# Altium project LimeSDR_1v2.PrjPcb (part 2 of 3)

## Sheet 11_USB3_0_device.SchDoc: USB3.0 device
size A3; Organization: Lime Microsystems; Address1: Surrey Tech Centre; Address2: Guildford GU2 7YG; Address3: Surray; Address4: United Kingdom; Revision: v1.2; SheetNumber: 11; SheetTotal: 14
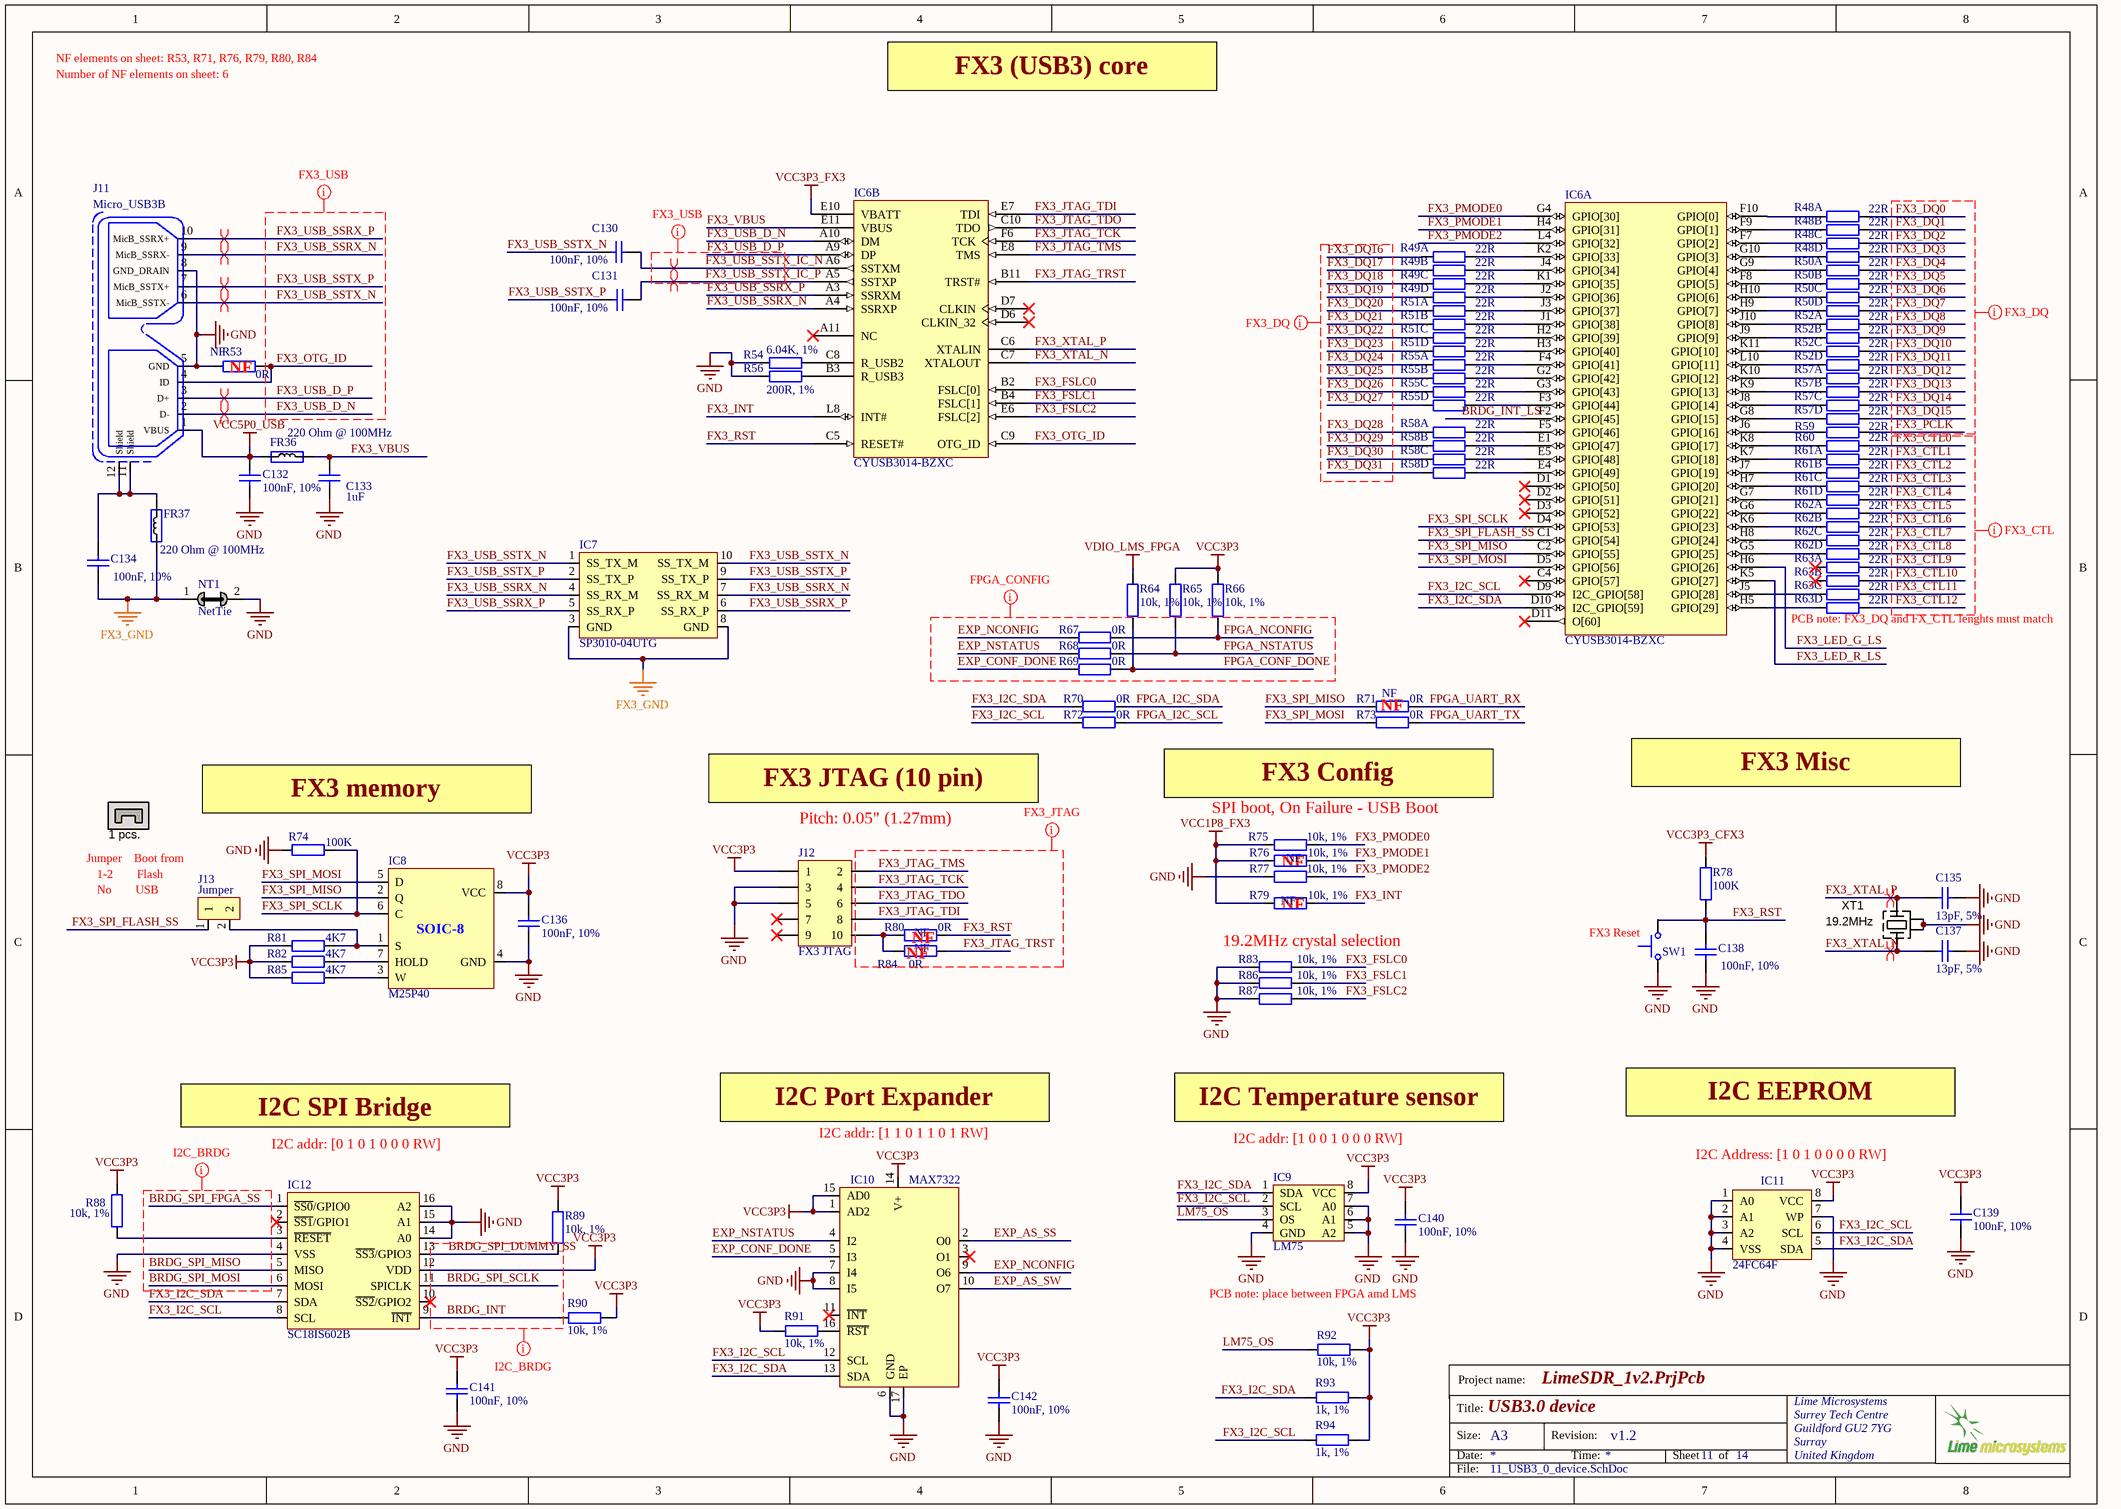
[diagram p5: 11_USB3_0_device.SchDoc]

### Parts
C130  100nF, 10%  [CAP0402]
C131  100nF, 10%  [CAP0402]
C132  100nF, 10%  [CAP0402]
C133  1uF  [CAP0603]
C134  100nF, 10%  [CAP0402]
C135  13pF, 5%  [CAP0402]
C136  100nF, 10%  [CAP0402]
C137  13pF, 5%  [CAP0402]
C138  100nF, 10%  [CAP0402]
C139  100nF, 10%  [CAP0402]
C140  100nF, 10%  [CAP0402]
C141  100nF, 10%  [CAP0402]
C142  100nF, 10%  [CAP0402]
FR36  220 Ohm @ 100MHz  [RES0402]
FR37  220 Ohm @ 100MHz  [RES0402]
IC6  CYUSB3014-BZXC  [CYP-BZX121]  (parts A,B of 3)
IC7  SP3010-04UTG  [SP3010-04UTG]
IC8  M25P40  [M25P40-VMN6TPB_SO8N]
IC9  LM75  [HWSON8_LM75]
IC10  MAX7322  [MAX7322ATE_QFN16]
IC11  24FC64F  [24FC512]
IC12  SC18IS602B  [SC18IS602B_TSSOP16]
J11  Micro_USB3B  [microUSB3B_SM_v2]
J12  FX3 JTAG  [SWD_10_pin]
J13  Jumper  [HDR_1x2_HALF_PITCH]
JMP1  1 pcs.  [MECH_JUMPER_HALF_PITCH]
NT1  NetTie  [NetTie_Wide2]  (net tie, no BOM)
R48  22R  [ChipResistorArray]  (parts A,B,C,D of 4)
R49  22R  [ChipResistorArray]  (parts A,B,C,D of 4)
R50  22R  [ChipResistorArray]  (parts A,B,C,D of 4)
R51  22R  [ChipResistorArray]  (parts A,B,C,D of 4)
R52  22R  [ChipResistorArray]  (parts A,B,C,D of 4)
R53  0R  Assembly Info: NF  [RES0402]
R54  6.04K, 1%  [RES0402]
R55  22R  [ChipResistorArray]  (parts A,B,C,D of 4)
R56  200R, 1%  [RES0402]
R57  22R  [ChipResistorArray]  (parts A,B,C,D of 4)
R58  22R  [ChipResistorArray]  (parts A,B,C,D of 4)
R59  22R  [RES0402]
R60  22R  [RES0402]
R61  22R  [ChipResistorArray]  (parts A,B,C,D of 4)
R62  22R  [ChipResistorArray]  (parts A,B,C,D of 4)
R63  22R  [ChipResistorArray]  (parts A,B,C,D of 4)
R64  10k, 1%  [RES0402]
R65  10k, 1%  [RES0402]
R66  10k, 1%  [RES0402]
R67  0R  [RES0402]
R68  0R  [RES0402]
R69  0R  [RES0402]
R70  0R  [RES0402]
R71  0R  Assembly Info: NF  [RES0402]
R72  0R  [RES0402]
R73  0R  [RES0402]
R74  100K  [RES0402]
R75  10k, 1%  [RES0402]
R76  10k, 1%  Assembly Info: NF  [RES0402]
R77  10k, 1%  [RES0402]
R78  100K  [RES0402]
R79  10k, 1%  Assembly Info: NF  [RES0402]
R80  0R  Assembly Info: NF  [RES0402]
R81  4K7  [RES0402]
R82  4K7  [RES0402]
R83  10k, 1%  [RES0402]
R84  0R  Assembly Info: NF  [RES0402]
R85  4K7  [RES0402]
R86  10k, 1%  [RES0402]
R87  10k, 1%  [RES0402]
R88  10k, 1%  [RES0402]
R89  10k, 1%  [RES0402]
R90  10k, 1%  [RES0402]
R91  10k, 1%  [RES0402]
R92  10k, 1%  [RES0402]
R93  1k, 1%  [RES0402]
R94  1k, 1%  [RES0402]
SW1  Switch, tactile  [SW_tactile]  (value not drawn)
XT1  19.2MHz  [CRYSTAL_4-LCC_v2]

### Nets
FX3_GND: C134.2 FR37.1 IC7.3(GND) IC7.8(GND) NT1.1
GND: C132.2 C133.1 C135.1 C136.2 C137.1 C138.2 C139.2 C140.2 C141.2 C142.2 IC8.4(GND) IC9.4(GND) IC9.5(A2) IC9.6(A1) IC9.7(A0) IC10.6(GND) IC10.7(I4) IC10.8(I5) IC10.17(EP) IC11.1(A0) IC11.2(A1) IC11.3(A2) IC11.4(VSS) IC11.7(WP) IC12.4(VSS) IC12.14(A0) IC12.15(A1) IC12.16(A2) J11.5(GND) J11.8(GND_DRAIN) J12.3 J12.5 NT1.2 R53.1 R54.1 R56.1 R74.1 R77.1 R83.1 R86.1 R87.1 SW1.1 XT1.2(GND) XT1.4(GND)
VCC1P8_FX3: R75.1 R76.1 R79.1
VCC3P3: C136.1 C139.1 C140.1 C141.1 C142.1 IC8.8(VCC) IC9.8(VCC) IC10.1(AD2) IC10.14(V+) IC10.15(AD0) IC11.8(VCC) IC12.12(VDD) J12.1 R65.1 R66.1 R81.1 R82.1 R85.1 R88.1 R89.2 R90.2 R91.1 R92.2 R93.1 R94.1
VCC3P3_CFX3: R78.2
VCC3P3_FX3: IC6.E10(VBATT)
VCC5P0_USB: C132.1 FR36.1 J11.1(VBUS)
VDIO_LMS_FPGA: R64.1
BRDG_INT: IC12.9(~{INT}) R90.1
BRDG_INT_LS: IC6.F2(GPIO[45])
BRDG_SPI_DUMMY_SS: IC12.13(~{SS3}/GPIO3) R89.1
BRDG_SPI_FPGA_SS: IC12.1(~{SS0}/GPIO0)
BRDG_SPI_MISO: IC12.5(MISO)
BRDG_SPI_MOSI: IC12.6(MOSI)
BRDG_SPI_SCLK: IC12.11(SPICLK)
EXP_AS_SS: IC10.2(O0)
EXP_AS_SW: IC10.10(O7)
EXP_CONF_DONE: IC10.5(I3) R69.1
EXP_NCONFIG: IC10.9(O6) R67.1
EXP_NSTATUS: IC10.4(I2) R68.1
FPGA_CONF_DONE: R64.2 R69.2
FPGA_I2C_SCL: R72.2
FPGA_I2C_SDA: R70.2
FPGA_NCONFIG: R66.2 R67.2
FPGA_NSTATUS: R65.2 R68.2
FPGA_UART_RX: R71.2
FPGA_UART_TX: R73.2
FX3_CTL0: R60.2
FX3_CTL1: R61.2
FX3_CTL2: R61.4
FX3_CTL3: R61.6
FX3_CTL4: R61.8
FX3_CTL5: R62.2
FX3_CTL6: R62.4
FX3_CTL7: R62.6
FX3_CTL8: R62.8
FX3_CTL9: R63.2
FX3_CTL10: R63.4
FX3_CTL11: R63.6
FX3_CTL12: R63.8
FX3_DQ0: R48.2
FX3_DQ1: R48.4
FX3_DQ2: R48.6
FX3_DQ3: R48.8
FX3_DQ4: R50.2
FX3_DQ5: R50.4
FX3_DQ6: R50.6
FX3_DQ7: R50.8
FX3_DQ8: R52.2
FX3_DQ9: R52.4
FX3_DQ10: R52.6
FX3_DQ11: R52.8
FX3_DQ12: R57.2
FX3_DQ13: R57.4
FX3_DQ14: R57.6
FX3_DQ15: R57.8
FX3_DQ16: R49.1
FX3_DQ17: R49.3
FX3_DQ18: R49.5
FX3_DQ19: R49.7
FX3_DQ20: R51.1
FX3_DQ21: R51.3
FX3_DQ22: R51.5
FX3_DQ23: R51.7
FX3_DQ24: R55.1
FX3_DQ25: R55.3
FX3_DQ26: R55.5
FX3_DQ27: R55.7
FX3_DQ28: R58.1
FX3_DQ29: R58.3
FX3_DQ30: R58.5
FX3_DQ31: R58.7
FX3_FSLC0: IC6.B2(FSLC[0]) R83.2
FX3_FSLC1: IC6.B4(FSLC[1]) R86.2
FX3_FSLC2: IC6.E6(FSLC[2]) R87.2
FX3_I2C_SCL: IC6.D9(I2C_GPIO[58]) IC9.2(SCL) IC10.12(SCL) IC11.6(SCL) IC12.8(SCL) R72.1 R94.2
FX3_I2C_SDA: IC6.D10(I2C_GPIO[59]) IC9.1(SDA) IC10.13(SDA) IC11.5(SDA) IC12.7(SDA) R70.1 R93.2
FX3_INT: IC6.L8(INT#) R79.2
FX3_JTAG_TCK: IC6.F6(TCK) J12.4
FX3_JTAG_TDI: IC6.E7(TDI) J12.8
FX3_JTAG_TDO: IC6.C10(TDO) J12.6
FX3_JTAG_TMS: IC6.E8(TMS) J12.2
FX3_JTAG_TRST: IC6.B11(TRST#) R84.1
FX3_LED_G_LS: IC6.H6(GPIO[26])
FX3_LED_R_LS: IC6.K5(GPIO[27])
FX3_OTG_ID: IC6.C9(OTG_ID) J11.4(ID) R53.2
FX3_PCLK: R59.1
FX3_PMODE0: IC6.G4(GPIO[30]) R75.2
FX3_PMODE1: IC6.H4(GPIO[31]) R76.2
FX3_PMODE2: IC6.L4(GPIO[32]) R77.2
FX3_RST: C138.1 IC6.C5(RESET#) R78.1 R80.2 SW1.2
FX3_SPI_FLASH_SS: IC6.C1(GPIO[54]) J13.1
FX3_SPI_MISO: IC6.C2(GPIO[55]) IC8.2(Q) R71.1
FX3_SPI_MOSI: IC6.D5(GPIO[56]) IC8.5(D) R73.1
FX3_SPI_SCLK: IC6.D4(GPIO[53]) IC8.6(C) R74.2
FX3_USB_D_N: IC6.A10(DM) J11.2(D-)
FX3_USB_D_P: IC6.A9(DP) J11.3(D+)
FX3_USB_SSRX_N: IC6.A4(SSRXP) IC7.4(SS_RX_M) IC7.7(SS_RX_M) J11.9(MicB_SSRX-)
FX3_USB_SSRX_P: IC6.A3(SSRXM) IC7.5(SS_RX_P) IC7.6(SS_RX_P) J11.10(MicB_SSRX+)
FX3_USB_SSTX_IC_N: C130.2 IC6.A6(SSTXM)
FX3_USB_SSTX_IC_P: C131.1 IC6.A5(SSTXP)
FX3_USB_SSTX_N: C130.1 IC7.1(SS_TX_M) IC7.10(SS_TX_M) J11.6(MicB_SSTX-)
FX3_USB_SSTX_P: C131.2 IC7.2(SS_TX_P) IC7.9(SS_TX_P) J11.7(MicB_SSTX+)
FX3_VBUS: C133.2 FR36.2 IC6.E11(VBUS)
FX3_XTAL_N: C137.2 IC6.C7(XTALOUT) XT1.3(X)
FX3_XTAL_P: C135.2 IC6.C6(XTALIN) XT1.1(X)
LM75_OS: IC9.3(OS) R92.1
NetC134_1: C134.1 FR37.2 J11.11(Shield) J11.12(Shield)
NetIC6_B3: IC6.B3(R_USB3) R56.2
NetIC6_C8: IC6.C8(R_USB2) R54.2
NetIC6_E1: IC6.E1(GPIO[47]) R58.4
NetIC6_E4: IC6.E4(GPIO[49]) R58.8
NetIC6_E5: IC6.E5(GPIO[48]) R58.6
NetIC6_F3: IC6.F3(GPIO[44]) R55.8
NetIC6_F4: IC6.F4(GPIO[41]) R55.2
NetIC6_F5: IC6.F5(GPIO[46]) R58.2
NetIC6_F7: IC6.F7(GPIO[2]) R48.5
NetIC6_F8: IC6.F8(GPIO[5]) R50.3
NetIC6_F9: IC6.F9(GPIO[1]) R48.3
NetIC6_F10: IC6.F10(GPIO[0]) R48.1
NetIC6_G2: IC6.G2(GPIO[42]) R55.4
NetIC6_G3: IC6.G3(GPIO[43]) R55.6
NetIC6_G5: IC6.G5(GPIO[25]) R62.7
NetIC6_G6: IC6.G6(GPIO[22]) R62.1
NetIC6_G7: IC6.G7(GPIO[21]) R61.7
NetIC6_G8: IC6.G8(GPIO[15]) R57.7
NetIC6_G9: IC6.G9(GPIO[4]) R50.1
NetIC6_G10: IC6.G10(GPIO[3]) R48.7
NetIC6_H2: IC6.H2(GPIO[39]) R51.6
NetIC6_H3: IC6.H3(GPIO[40]) R51.8
NetIC6_H5: IC6.H5(GPIO[29]) R63.7
NetIC6_H7: IC6.H7(GPIO[20]) R61.5
NetIC6_H8: IC6.H8(GPIO[24]) R62.5
NetIC6_H9: IC6.H9(GPIO[7]) R50.7
NetIC6_H10: IC6.H10(GPIO[6]) R50.5
NetIC6_J1: IC6.J1(GPIO[38]) R51.4
NetIC6_J2: IC6.J2(GPIO[36]) R49.8
NetIC6_J3: IC6.J3(GPIO[37]) R51.2
NetIC6_J4: IC6.J4(GPIO[34]) R49.4
NetIC6_J5: IC6.J5(GPIO[28]) R63.5
NetIC6_J6: IC6.J6(GPIO[16]) R59.2
NetIC6_J7: IC6.J7(GPIO[19]) R61.3
NetIC6_J8: IC6.J8(GPIO[14]) R57.5
NetIC6_J9: IC6.J9(GPIO[9]) R52.3
NetIC6_J10: IC6.J10(GPIO[8]) R52.1
NetIC6_K1: IC6.K1(GPIO[35]) R49.6
NetIC6_K2: IC6.K2(GPIO[33]) R49.2
NetIC6_K6: IC6.K6(GPIO[23]) R62.3
NetIC6_K7: IC6.K7(GPIO[18]) R61.1
NetIC6_K8: IC6.K8(GPIO[17]) R60.1
NetIC6_K9: IC6.K9(GPIO[13]) R57.3
NetIC6_K10: IC6.K10(GPIO[12]) R57.1
NetIC6_K11: IC6.K11(GPIO[10]) R52.5
NetIC6_L10: IC6.L10(GPIO[11]) R52.7
NetIC8_1: IC8.1(S) J13.2 R81.2
NetIC8_3: IC8.3(W) R85.2
NetIC8_7: IC8.7(HOLD) R82.2
NetIC10_16: IC10.16(~{RST}) R91.2
NetIC12_3: IC12.3(~{RES}~{ET}) R88.2
NetJ12_10: J12.10 R80.1 R84.2

Not connected (* = marked no-connect by the designer): IC6 A11(NC)* C4(GPIO[57])* D1(GPIO[50])* D2(GPIO[51])* D3(GPIO[52])* D6(CLKIN_32)* D7(CLKIN)* D11(O[60])*; IC10 3(O1)* 11(~{INT})*; IC12 2(~{SS1}/GPIO1)* 10(~{SS2}/GPIO2)*; J12 7* 9*; JMP1 1 2; R63 1* 3*

### Layout directives
differential pair: FX3_USB_D_N, FX3_USB_D_P, FX3_USB_SSRX_N, FX3_USB_SSRX_P, FX3_USB_SSTX_IC_N, FX3_USB_SSTX_IC_P, FX3_USB_SSTX_N, FX3_USB_SSTX_P, FX3_XTAL_N, FX3_XTAL_P
net class FX3_DATA: FX3_OTG_ID, FX3_USB_D_N, FX3_USB_D_P, FX3_USB_SSRX_N, FX3_USB_SSRX_P, FX3_USB_SSTX_IC_N, FX3_USB_SSTX_IC_P, FX3_USB_SSTX_N, FX3_USB_SSTX_P
net class FX3_CTL: FX3_CTL0, FX3_CTL1, FX3_CTL2, FX3_CTL3, FX3_CTL4, FX3_CTL5, FX3_CTL6, FX3_CTL7, FX3_CTL8, FX3_CTL9, FX3_CTL10, FX3_CTL11, FX3_CTL12
net class FX3_DQ: FX3_DQ0, FX3_DQ1, FX3_DQ2, FX3_DQ3, FX3_DQ4, FX3_DQ5, FX3_DQ6, FX3_DQ7, FX3_DQ8, FX3_DQ9, FX3_DQ10, FX3_DQ11, FX3_DQ12, FX3_DQ13, FX3_DQ14, FX3_DQ15, FX3_DQ16, FX3_DQ17, FX3_DQ18, FX3_DQ19, FX3_DQ20, FX3_DQ21, FX3_DQ22, FX3_DQ23, FX3_DQ24, FX3_DQ25, FX3_DQ26, FX3_DQ27, FX3_DQ28, FX3_DQ29, FX3_DQ30, FX3_DQ31, FX3_PCLK
net class I2C_BRDG: BRDG_INT, BRDG_SPI_DUMMY_SS, BRDG_SPI_FPGA_SS, BRDG_SPI_MISO, BRDG_SPI_MOSI, BRDG_SPI_SCLK
net class FX3_JTAG: FX3_JTAG_TCK, FX3_JTAG_TDI, FX3_JTAG_TDO, FX3_JTAG_TMS, FX3_JTAG_TRST, FX3_RST
net class FPGA_CONFIG: EXP_CONF_DONE, EXP_NCONFIG, EXP_NSTATUS, FPGA_CONF_DONE, FPGA_NCONFIG, FPGA_NSTATUS

### Notes on the sheet
- Number of NF elements on sheet: 6
- NF elements on sheet: R53, R71, R76, R79, R80, R84
- FX3 (USB3) core
- (near R53) NF
- (near R63) PCB note: FX3_DQ and FX_CTL lenghts must match
- (near R71) NF
- FX3 Misc
- FX3 memory
- FX3 JTAG (10 pin)
- (near J12) Pitch: 0.05" (1.27mm)
- FX3 Config
- SPI boot, On Failure - USB Boot
- Jumper    Boot from
- (near J13) 1-2        Flash
- (near J13) No        USB
- (near R79) NF
- (near R76) NF
- (near R84) NF
- NF
- (near R83) 19.2MHz crystal selection
- (near SW1) FX3 Reset
- I2C SPI Bridge
- I2C Port Expander
- I2C Temperature sensor
- I2C EEPROM
- (near IC12) I2C addr: [0 1 0 1 0 0 0 RW]
- (near IC10) I2C addr: [1 1 0 1 1 0 1 RW]
- I2C addr: [1 0 0 1 0 0 0 RW]
- (near IC11) I2C Address: [1 0 1 0 0 0 0 RW]
- PCB note: place between FPGA amd LMS
- Project name:
- Title:
- Size:
- Date:
- A3
- Revision:
- Time:
- Sheet
- of
- File:
- (in symbol M25P40) SOIC-8

### Library data of the parts
C130 C131 C134 C136 C138-C142 = Cap_0603: Manufacturer Part Number 1: GRM155R71C104KA88D; Part Description: 0.10µF ±10% 16V X7R Ceramic Capacitor -55°C ~ 125°C Surface Mount, MLCC 0402 (1005 Metric) 0.039" L x 0.020" W (1.00mm x 0.50mm); Brand: Murata Electronics; Type: General Purpose MLCC; Capacitance: 0.1 uF; Temperature Coefficient / Code: +/- 15 %; Voltage Rating DC: 16 V; Supplier 1: Mouser; Supplier Part Number 1: 81-GRM155R71C104KA88; Tolerance: 10 %; Case Code - in: 0402; Manufacturer: Murata Electronics; Category: Multilayer Ceramic Capacitors MLCC - SMD/SMT; Value: 100nF, 10%; Manufacturer Part Number: GRM155R71C104KA88D
C132 = Cap_0402: Manufacturer: Murata Electronics; Manufacturer Part Number: GRM155R71C104KA88D; Part Description: 0.10µF ±10% 16V X7R Ceramic Capacitor -55°C ~ 125°C Surface Mount, MLCC 0402 (1005 Metric) 0.039" L x 0.020" W (1.00mm x 0.50mm); Voltage Rating DC: 16 V; Type: General Purpose MLCC; Capacitance: 0.1 uF; Case Length: 1 mm; Dielectric: X7R; Case Height: 0.5 mm; Temperature Coefficient / Code: +/- 15 %; Value: 100nF, 10%; Supplier 1: Mouser; Supplier Part Number 1: 81-GRM155R71C104KA88; Case Code - in: 0402; RoHS: RoHS Compliant; Operating Temperature Range: - 55 C to + 125 C; Series: GRM; Termination Style: SMD/SMT; Tolerance: 10 %; Package / Case: 0402 (1005 metric); Maximum Operating Temperature: + 125 C; Case Code - mm: 1005; Minimum Operating Temperature: - 55 C; Product Category: Low & Medium Capacitance SMD Ceramic Chip Capacitors; Packaging: Reel; Product: General Type MLCCs; Category: Multilayer Ceramic Capacitors MLCC - SMD/SMT; Brand: Murata Electronics; Case Width: 0.5 mm; RoHS - Mouser: Y; Standard Pack Qty: 10000; Minimum Order Quantity: 1; Reeling: True; Manufacturer Part Number 1: GRM155R71C104KA88D
C133 = Cap_0603: Manufacturer: Yageo; Manufacturer Part Number 1: CC0603KPX7R9BB103; Part Description: 10000pF ±10% 50V X7R Ceramic Capacitor -55°C ~ 125°C Surface Mount, MLCC 0603 (1608 Metric) 0.063" L x 0.031" W (1.60mm x 0.80mm); Temperature Coefficient: X7R; Voltage - Rated: 50V; Tolerance: ±10%; Capacitance: 10000pF; Supplier 1: Digi-Key; Supplier Part Number 1: 311-1572-1-ND; Mounting Type: Surface Mount, MLCC; Size / Dimension: 0.063" L x 0.031" W (1.60mm x 0.80mm); Package / Case: 0603 (1608 Metric); Lead Style: -; Ratings: -; Applications: General Purpose; Operating Temperature: -55°C ~ 125°C; Lead Spacing: -; Thickness (Max): 0.035" (0.90mm); Features: -; Height - Seated (Max): -; Category: Capacitors; Packaging: Cut Tape (CT); RoHS: RoHS Compliant; Value: 1uF
C135 C137 = Cap_0603: Manufacturer: Murata Electronics North America; Part Description: 13pF ±5% 50V C0G, NP0 Ceramic Capacitor -55°C ~ 125°C Surface Mount, MLCC 0402 (1005 Metric) 0.039" L x 0.020" W (1.00mm x 0.50mm); Voltage - Rated: 50V; Supplier 1: Digi-Key; Supplier Part Number 1: 490-5925-2-ND; Tolerance: ±5%; Capacitance: 13pF; Category: Capacitors; Package / Case: 0402 (1005 Metric); Value: 13pF, 5%
FR36 FR37 = Ferrite: Manufacturer: TDK Corporation; Part Description: FERRITE BEAD 220 OHM 0402 1LN; Current Rating: 900mA; DC Resistance (DCR): 220 mOhm Max; Supplier 1: Digi-Key; Impedance @ Frequency: 220 Ohm @ 100MHz; Package / Case: 0402 (1005 Metric); Category: Filters; Value: 220 Ohm @ 100MHz
  FR36: Supplier Part Number 1: 445-9329-2-ND
  FR37: Supplier Part Number: 445-9329-2-ND
IC6 = CYUSB3014-BZXC: EZ-USB(R) FX3: SuperSpeed USB Controller, 512 KB, 60 I/Os, 0 to 70 degC, 121-Pin FBGA (BZX121); Manufacturer: Cypress Semiconductor Corp; CPU Core: ARM926 EJ-S; Max. Operating Voltage (V): 1.25; Memory Architecture: SRAM; Memory Size (KB): 512; Min. Operating Voltage (V): 1.15; No. of I/Os: 60; DatasheetVersion: Rev. *O; PackageVersion: Rev. *D; PackageReference: BZX121; PackageDescription: 121-Ball FBGA, Body 10 x 10 mm, Pitch 0.8 mm; Supplier 1: Digi-Key; Supplier Part Number 1: 428-3182-ND; Supplier 2: Farnell; Supplier Part Number 2: 2355789; Supplier 3: Newark; Supplier Part Number 3: 54W7901; Supplier 4: Mouser; Supplier Part Number 4: 727-CYUSB3014-BZXC; Max. Operating Temp. (degreesC): 70; Min. Operating Temp. (degreesC): 0; RoHS: Pb-Free; Mounting Technology: Surface Mount; Code_JEDEC: PUB 95; PartNumber: CYUSB3014-BZXC; ComponentLink1Description: Manufacturer URL; ComponentLink1URL: http://www.cypress.com/; ComponentLink2Description: Datasheet; ComponentLink2URL: http://www.cypress.com/?docID=49087; ComponentLink3Description: Package Specification; ComponentLink3URL: http://www.cypress.com/?docID=45795; Part Description: EZ-USB(R) FX3: SuperSpeed USB Controller, 512 KB, 60 I/Os, 0 to 70 degC, 121-Pin FBGA (BZX121)
IC7 = SP3010-04UTG: Manufacturer: Littelfuse Inc; Part Description: TVS DIODE 6VWM 12.3VC UDFN; Supplier 1: Digi-Key; Category: Circuit Protection; Supplier Device Package: 10-µDFN (2.5x1.0); Supplier Part Number 1: F3507TR-ND; Manufacturer Part Number 1: SP3010-04UTG
IC8 = M25P40: Manufacturer: Micron Technology Inc; Part Description: IC FLASH 4MBIT 75MHZ 8SO; Manufacturer Part Number 1: M25P40-VMN6TPB; Memory Size: 4M (512K x 8); Voltage - Supply: 2.3 V ~ 3.6 V; Supplier 1: Digi-Key; Supplier Device Package: 8-SO; Supplier Part Number 1: M25P40-VMN6TPBTR-ND
IC9 = LM75: Manufacturer: NXP Semiconductors; Manufacturer Part Number: LM75BTP,147; Part Description: SENSOR TEMPERATURE I2C 8HWSON; Sensing Temperature - Local: -55°C ~ 125°C; Output Type: I²C; Accuracy - Highest (Lowest): ±2°C (±3°C); Voltage - Supply: 2.8 V ~ 5.5 V; Test Condition: -25°C ~ 100°C (-55°C ~ 125°C); Sensor Type: Digital, Local; Resolution: 10 b; Supplier 1: Digi-Key; Operating Temperature: -55°C ~ 125°C; Features: Output Switch, Programmable Limit, Shutdown Mode; Supplier Device Package: 8-HWSON (2x3); Sensing Temperature - Remote: -; Category: Sensors, Transducers; Packaging: Tape & Reel (TR); RoHS: RoHS Compliant; Package / Case: 8-WFDFN Exposed Pad; Supplier Part Number 1: 568-9815-2-ND
IC10 = MAX7322ATE+: Manufacturer: Maxim Integrated; Part Description: IC I/O EXPANDER I2C 4B 16TQFN; Interface: I²C; Number of I/O: 4 (Input Only); Voltage - Supply: 1.7 V ~ 5.5 V; Interrupt Output: Yes; Current - Output Source/Sink: 20mA; Frequency - Clock: 400kHz; Supplier 1: Digi-Key; Mounting Type: Surface Mount; Category: Integrated Circuits (ICs); RoHS: RoHS Compliant; Packaging: Tube; Manufacturer Part Number: MAX7322ATE+; Supplier Device Package: 16-TQFN-EP (3x3); Package / Case: 16-WFQFN Exposed Pad; Operating Temperature: -40°C ~ 125°C; Features: POR; Output Type: -; Supplier Part Number 1: MAX7322ATE+-ND
IC11 = 24FC64F: Manufacturer Part Number 1: 24FC64F-I/ST; Manufacturer: Microchip Technology; Part Description: IC EEPROM 512KBIT 1MHZ 8TSSOP; Format - Memory: EEPROMs - Serial; Speed: 400kHz, 1MHz; Interface: I²C, 2-Wire Serial; Memory Type: EEPROM; Memory Size: 64K (8K x 8); Voltage - Supply: 1.7 V ~ 5.5 V; Supplier 1: Digi-Key; Packaging: Tube; Supplier Device Package: 8-TSSOP; Operating Temperature: -40°C ~ 85°C; RoHS: RoHS Compliant; Category: Integrated Circuits (ICs); Package / Case: 8-TSSOP (0.173", 4.40mm Width); Supplier Part Number 1: 24FC64F-I/ST-ND
IC12 = SC18IS602: Manufacturer Part Number 1: SC18IS602BIPW,112; Manufacturer: NXP Semiconductors; Part Description: IC BRIDGE SPI/I2C 16-TSSOP; Interface: SPI; Voltage - Supply: 2.4 V ~ 3.6 V; Current - Supply: 11mA; Function: Controller; Protocol: I²C; Standards: -; Operating Temperature: -40°C ~ 85°C; RoHS: RoHS Compliant; Packaging: Tube; Category: Integrated Circuits (ICs); Supplier Device Package: 16-TSSOP; Package / Case: 16-TSSOP (0.173", 4.40mm Width); Supplier 1: Digi-Key; Supplier Part Number 1: 568-4785-5-ND
J11 = Micro_USB3_B: Manufacturer: Amphenol Commercial Products; Manufacturer Part Number 1: GSB443T33HR; Part Description: USB1065-30-A  USB, 3.0 TYPE A, PLUG, SMT; Connector Type: USB - micro B; Specifications: USB 3.1, Superspeed+; Gender: Receptacle; Number of Contacts: 10; Supplier 1: Digi-Key; Supplier Part Number 1: GSB443T33HRCT-ND; Category: Connectors, Interconnects; Features: Board Guide; Ingress Protection: -; RoHS: RoHS Compliant; Packaging: Cut Tape (CT); Mounting Type: Surface Mount, Right Angle, Horizontal
J12 = Header 5X2_SWD: Header, 5-Pin, Dual row; Manufacturer Part Number 1: M50-3600542; Manufacturer: Harwin Inc; Part Description: CONN HDR 1.27MM SMD AU 10POS; Number of Positions: 10; Molding Height Above Board: 0.039" (1.00mm); Row Spacing: 0.050" (1.27mm); Number of Positions Loaded: All; Connector Type: Unshrouded; Supplier 1: Digi-Key; Contact Mating Length: 0.118" (3.00mm); Category: Connectors, Interconnects; Color: Black; RoHS: RoHS Compliant; Number of Rows: 2; Contact Finish Thickness: 3µin (0.08µm); Height Stacking (Mating): -; Contact Finish: Gold; Termination: Solder; Mounting Type: Surface Mount; Pitch: 0.050" (1.27mm); Features: -; Packaging: Bulk; Supplier Part Number 1: 952-1389-ND
J13 = Jumper: Manufacturer Part Number 1: GRPB021VWVN-RC; Manufacturer: Sullins Connector Solutions; Part Description: 2 Positions Header, Unshrouded Connector 0.050" (1.27mm) Through Hole Gold; Connector Type: Header, Unshrouded; Number of Positions: 2; Number of Positions Loaded: All; Pitch: 0.050" (1.27mm); Supplier 1: Digi-Key; Supplier Part Number 1: S9014E-02-ND; Contact Mating Length: 0.118" (3.00mm); Mounting Type: Through Hole; Termination: Solder; Fastening Type: -; Features: -; Contact Finish: Gold; Contact Finish Thickness: Flash; Color: -; Category: Connectors, Interconnects; RoHS: RoHS Compliant; Packaging: Bulk; Contact Type: Male Pin; Number of Rows: 1; Row Spacing: -
JMP1 = JUMP_2P_CONN_HEADER: Shorting Jumper, 2-position, 1.27mm pitch; Manufacturer Part Number 1: M50-2030005; Manufacturer: Harwin Inc.; Part Description: CONN SHUNT 1.27MM BLUE W/HANDLE; Gender: Female Sockets; Number of Positions or Pins (Grid): 2 (1 x 2); Pitch: 0.050" (1.27mm); Supplier 1: Digi-Key; Supplier Part Number 1: 952-1732-ND; Category: Connectors, Interconnects; RoHS: RoHS Compliant; Packaging: Bulk; Type: Closed Top, Grip; Height: 0.217" (5.50mm); Contact Finish: Gold; Contact Finish Thickness: 1µin (0.025µm); Color: Blue
R48-R52 R55 R57 R58 R61-R63 = ResArray_0802: Part Description: RES ARRAY 4 RES 22 OHM 0804; Manufacturer: Yageo; Manufacturer Part Number 1: YC124-JR-0722RL; Temperature Coefficient: ±200ppm/°C; Tolerance: ±5%; Supplier 1: Digi-Key; Supplier Part Number 1: YC124J-22TR-ND; Package / Case: 0804, Convex, Long Side Terminals; Value: 22R
R53 R67-R73 R80 = Res_0402: Manufacturer: Yageo; Part Description: RES SMD 0.0OHM JUMPER 1/16W 0402; Supplier 1: Digi-Key; Supplier Part Number 1: 311-0.0JRTR-ND; Composition: Thick Film; Package / Case: 0402 (1005 Metric); Category: Resistors; Value: 0R
R54 = Res_0402: Manufacturer: Rohm Semiconductor; Manufacturer Part Number 1: MCR01MRTF6041; Part Description: RES SMD 6.04K OHM 1% 1/16W 0402; Temperature Coefficient: ±100ppm/°C; Supplier Part Number 1: RHM6.04KCDTR-ND; Supplier 1: Digi-Key; Category: Resistors; Supplier Device Package: 0402 (1005 Metric); Composition: Thick Film; Tolerance: ±1%; Value: 6.04K, 1%
R56 = Res_0402: Manufacturer: Stackpole Electronics Inc; Part Description: RES SMD 200 OHM 1% 1/16W 0402; Power (Watts): 0.063W, 1/16W; Resistance (Ohms): 200; Temperature Coefficient: ±100ppm/°C; Supplier 1: Digi-Key; Supplier Device Package: 0402; Composition: Thick Film; Category: Resistors; Tolerance: ±1%; Supplier Part Number 1: RMCF0402FT200RDKR-ND; Value: 200R, 1%
R59 R60 = Res_0402: Part Description: RES SMD 22 OHM 1% 1/16W 0402; Tolerance: ±1%; Temperature Coefficient: ±100ppm/°C; Resistance (Ohms): 22; Supplier 1: Digi-Key; Supplier Part Number 1: 311-22.0LRTR-ND; Supplier Device Package: 0402; Composition: Thick Film; Category: Resistors; Value: 22R
R64-R66 R75-R77 R79 R83 R86-R92 = Res_0402: Manufacturer: Yageo; Manufacturer Part Number 1: RC0402FR-0710KL; Part Description: RES SMD 10K OHM 1% 1/16W 0402; Temperature Coefficient: ±100ppm/°C; Power (Watts): 0.063W, 1/16W; Value: 10k, 1%; Supplier 1: Digi-Key; Supplier Part Number 1: 311-10.0KLRTR-ND; Resistance (Ohms): 10k; Packaging: Tape & Reel (TR); RoHS: RoHS Compliant; Package / Case: 0402 (1005 Metric); Tolerance: ±1%; Operating Temperature: -55°C ~ 155°C; Size / Dimension: 0.039" L x 0.020" W (1.00mm x 0.50mm); Number of Terminations: 2; Category: Resistors; Height: 0.016" (0.40mm); Supplier Device Package: 0402; Features: Moisture Resistant; Composition: Thick Film
R74 R78 = Res_0402: Manufacturer Part Number 1: ERJ-2GEJ104X; Manufacturer: Panasonic Electronic Components; Part Description: RES SMD 100K OHM 5% 1/10W 0402; Tolerance: ±5%; Temperature Coefficient: ±200ppm/°C; Power (Watts): 0.1W, 1/10W; Value: 100K; Supplier 1: Digi-Key; Supplier Part Number 1: P100KJCT-ND; Resistance (Ohms): 100k; Composition: Thick Film; Features: Automotive AEC-Q200; Number of Terminations: 2; Height: 0.016" (0.40mm); RoHS: RoHS Compliant; Package / Case: 0402 (1005 Metric); Packaging: Cut Tape (CT); Size / Dimension: 0.039" L x 0.020" W (1.00mm x 0.50mm); Supplier Device Package: 0402; Operating Temperature: -55°C ~ 155°C; Category: Resistors
R81 R82 R85 = Res_0402: Manufacturer Part Number 1: RMCF0402JT4K70; Part Description: RES SMD 4.7K OHM 5% 1/16W 0402; Manufacturer: Stackpole Electronics Inc.; Temperature Coefficient: ±100ppm/°C; Resistance(Ohms): 4.7k; Tolerance: ±5%; Supplier 1: Digi-Key; Composition: Thick Film; Supplier Device Package: 0402; Supplier: Digi-Key; Supplier Part Number 1: RMCF0402JT4K70TR-ND; Category: Resistors; Value: 4K7
R84 = Res_0402: Manufacturer Part Number 1: RC0402JR-070RL; Manufacturer: Yageo; Part Description: RES SMD 0.0OHM JUMPER 1/16W 0402; Resistance (Ohms): 0.0; Tolerance: Jumper; Power (Watts): 0.063W, 1/16W; Value: 0R; Supplier 1: Digi-Key; Supplier Part Number 1: 311-0.0JRTR-ND; Category: Resistors; Temperature Coefficient: -; Features: Moisture Resistant; Supplier Device Package: 0402; Height: 0.016" (0.40mm); Package / Case: 0402 (1005 Metric); Operating Temperature: -55°C ~ 155°C; Size / Dimension: 0.039" L x 0.020" W (1.00mm x 0.50mm); Composition: Thick Film; Packaging: Tape & Reel (TR); Number of Terminations: 2; RoHS: RoHS Compliant
R93 R94 = Res_0402: Manufacturer: Stackpole Electronics Inc; Manufacturer Part Number 1: RMCF0402FT1K00; Part Description: RES SMD 1K OHM 1% 1/16W 0402; Temperature Coefficient: ±100ppm/°C; Power (Watts): 0.063W, 1/16W; Value: 1k, 1%; Supplier 1: Digi-Key; Supplier Part Number 1: RMCF0402FT1K00TR-ND; Package / Case: 0402 (1005 Metric); Supplier Device Package: 0402; Height: 0.016" (0.40mm); Size / Dimension: 0.039" L x 0.020" W (1.00mm x 0.50mm); Number of Terminations: 2; Packaging: Cut Tape (CT); Category: Resistors; Composition: Thick Film; Resistance (Ohms): 1k; Tolerance: ±1%; Features: Moisture Resistant; Operating Temperature: -55°C ~ 155°C; RoHS: RoHS Compliant
SW1 = Button: Part Description: SWITCH TACTILE SPST-NO 0.05A 12V; Manufacturer: Omron Electronics Inc-EMC Div; Manufacturer Part Number 1: B3U-1000P; Outline: 3.00mm x 2.50mm; Actuator Type: Standard; Mechanical Life: 200,000 Cycles; Actuator Orientation: Top Actuated; Supplier 1: Digi-Key; Supplier Part Number 1: SW1020TR-ND; Category: Switches
XT1 = CRYSTAL_19M2: Oscillator Crystal 19.2 MHz; Manufacturer Part Number 1: 405C35B19M20000; Manufacturer: CTS-Frequency Controls; Part Description: 19.2MHz ±30ppm Crystal 13pF 60 Ohm -20°C ~ 70°C Surface Mount 4-SMD, No Lead (DFN, LCC); Frequency Tolerance: ±30ppm; ESR (Equivalent Series Resistance): 60 Ohm; Load Capacitance: 13pF; Frequency Stability: ±50ppm; Operating Mode: Fundamental; Supplier 1: Digi-Key; Supplier Part Number 1: CTX648CT-ND; Height: 0.041" (1.05mm); Category: Crystals and Oscillators; Package / Case: 4-SMD, No Lead (DFN, LCC); Mounting Type: Surface Mount; Operating Temperature: -20°C ~ 70°C; Size / Dimension: 0.197" L x 0.126" W (5.00mm x 3.20mm); Frequency: 19.2MHz

## Sheet 12_USB3_0_power.SchDoc: USB3.0 power
size A4; Organization: Lime Microsystems; Address1: Surrey Tech Centre; Address2: Guildford GU2 7YG; Address3: Surray; Address4: United Kingdom; Revision: v1.2; SheetNumber: 12; SheetTotal: 14
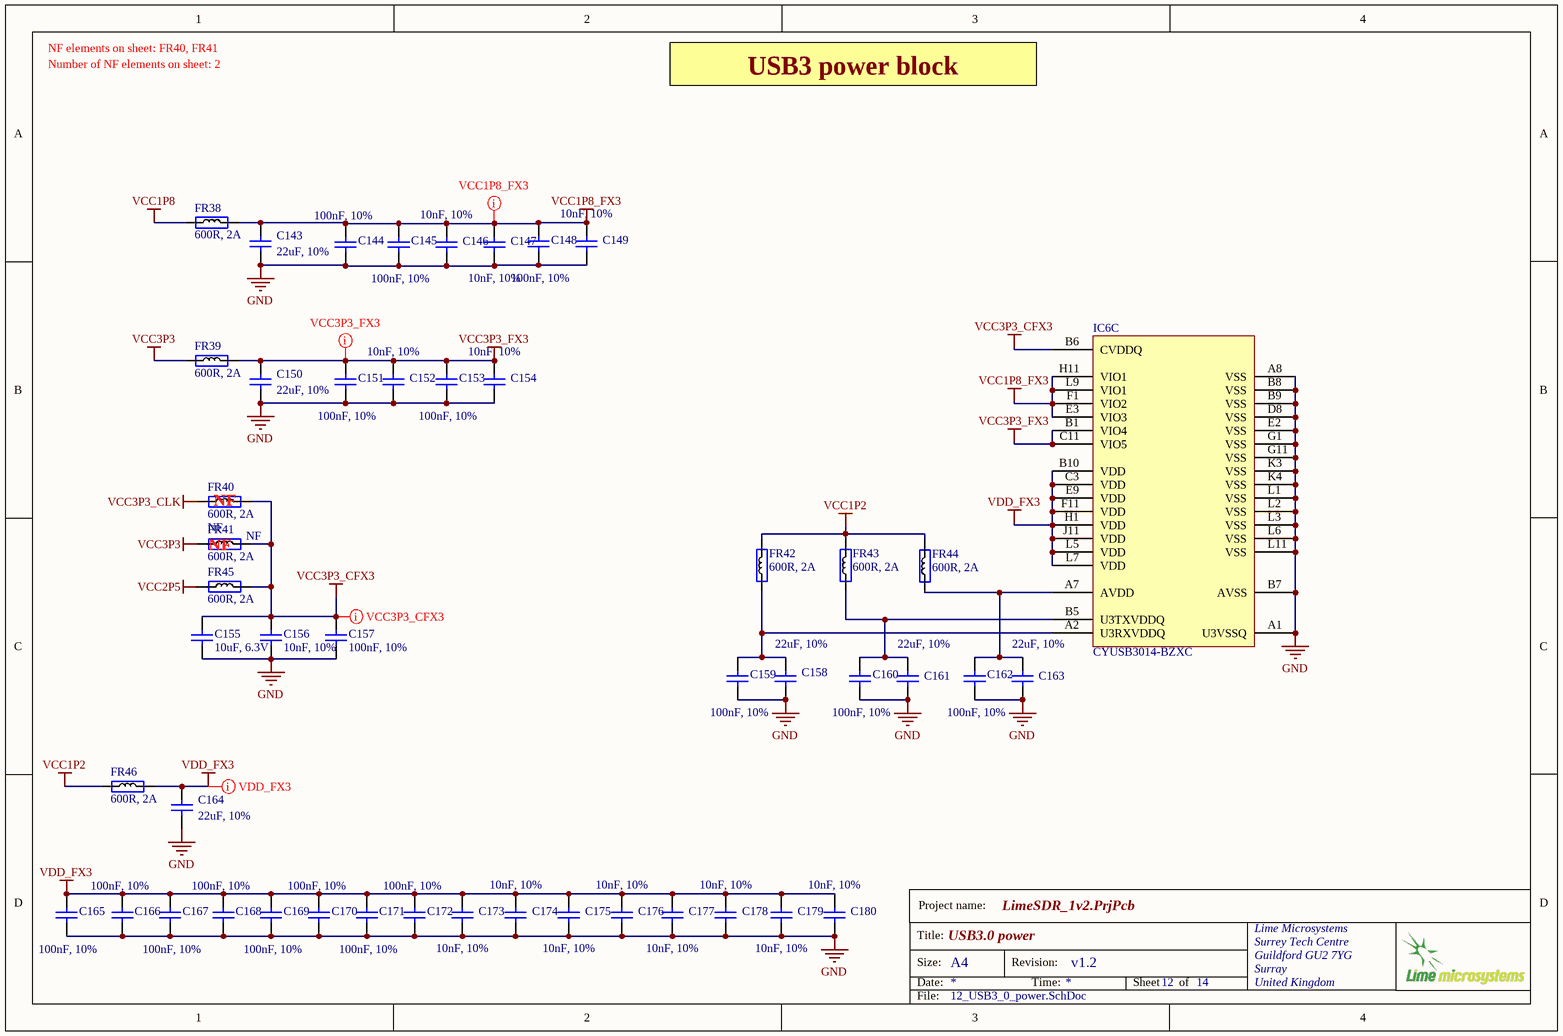
[diagram p6: 12_USB3_0_power.SchDoc]

### Parts
C143  22uF, 10%  [CAP0603]
C144  100nF, 10%  [CAP0402]
C145  100nF, 10%  [CAP0402]
C146  10nF, 10%  [CAP0402]
C147  10nF, 10%  [CAP0402]
C148  100nF, 10%  [CAP0402]
C149  10nF, 10%  [CAP0402]
C150  22uF, 10%  [CAP0603]
C151  100nF, 10%  [CAP0402]
C152  10nF, 10%  [CAP0402]
C153  100nF, 10%  [CAP0402]
C154  10nF, 10%  [CAP0402]
C155  10uF, 6.3V  [CAP0603]
C156  10nF, 10%  [CAP0402]
C157  100nF, 10%  [CAP0402]
C158  22uF, 10%  [CAP0603]
C159  100nF, 10%  [CAP0402]
C160  100nF, 10%  [CAP0402]
C161  22uF, 10%  [CAP0603]
C162  100nF, 10%  [CAP0402]
C163  22uF, 10%  [CAP0603]
C164  22uF, 10%  [CAP0603]
C165  100nF, 10%  [CAP0402]
C166  100nF, 10%  [CAP0402]
C167  100nF, 10%  [CAP0402]
C168  100nF, 10%  [CAP0402]
C169  100nF, 10%  [CAP0402]
C170  100nF, 10%  [CAP0402]
C171  100nF, 10%  [CAP0402]
C172  100nF, 10%  [CAP0402]
C173  10nF, 10%  [CAP0402]
C174  10nF, 10%  [CAP0402]
C175  10nF, 10%  [CAP0402]
C176  10nF, 10%  [CAP0402]
C177  10nF, 10%  [CAP0402]
C178  10nF, 10%  [CAP0402]
C179  10nF, 10%  [CAP0402]
C180  10nF, 10%  [CAP0402]
FR38  600R, 2A  [RES0805]
FR39  600R, 2A  [RES0805]
FR40  600R, 2A  Assembly Info: NF  [RES0805]
FR41  600R, 2A  Assembly Info: NF  [RES0805]
FR42  600R, 2A  [RES0805]
FR43  600R, 2A  [RES0805]
FR44  600R, 2A  [RES0805]
FR45  600R, 2A  [RES0805]
FR46  600R, 2A  [RES0805]
IC6  CYUSB3014-BZXC  [CYP-BZX121]  (part C of 3)

### Nets
GND: C143.1 C144.2 C145.2 C146.1 C147.1 C148.2 C149.1 C150.1 C151.2 C152.1 C153.2 C154.1 C155.1 C156.1 C157.2 C158.1 C159.2 C160.2 C161.1 C162.2 C163.1 C164.1 C165.2 C166.2 C167.2 C168.2 C169.2 C170.2 C171.2 C172.2 C173.1 C174.1 C175.1 C176.1 C177.1 C178.1 C179.1 C180.1 IC6.A1(U3VSSQ) IC6.A8(VSS) IC6.B7(AVSS) IC6.B8(VSS) IC6.B9(VSS) IC6.D8(VSS) IC6.E2(VSS) IC6.G1(VSS) IC6.G11(VSS) IC6.K3(VSS) IC6.K4(VSS) IC6.L1(VSS) IC6.L2(VSS) IC6.L3(VSS) IC6.L6(VSS) IC6.L11(VSS)
VCC1P2: FR42.2 FR43.2 FR44.2 FR46.1
VCC1P8: FR38.1
VCC1P8_FX3: C143.2 C144.1 C145.1 C146.2 C147.2 C148.1 C149.2 FR38.2 IC6.E3(VIO3) IC6.F1(VIO2) IC6.H11(VIO1) IC6.L9(VIO1)
VCC2P5: FR45.2
VCC3P3: FR39.1 FR41.2
VCC3P3_CFX3: C155.2 C156.2 C157.1 FR40.1 FR41.1 FR45.1 IC6.B6(CVDDQ)
VCC3P3_CLK: FR40.2
VCC3P3_FX3: C150.2 C151.1 C152.2 C153.1 C154.2 FR39.2 IC6.B1(VIO4) IC6.C11(VIO5)
VDD_FX3: C164.2 C165.1 C166.1 C167.1 C168.1 C169.1 C170.1 C171.1 C172.1 C173.2 C174.2 C175.2 C176.2 C177.2 C178.2 C179.2 C180.2 FR46.2 IC6.B10(VDD) IC6.C3(VDD) IC6.E9(VDD) IC6.F11(VDD) IC6.H1(VDD) IC6.J11(VDD) IC6.L5(VDD) IC6.L7(VDD)
NetC158_2: C158.2 C159.1 FR42.1 IC6.A2(U3RXVDDQ)
NetC160_1: C160.1 C161.2 FR43.1 IC6.B5(U3TXVDDQ)
NetC162_1: C162.1 C163.2 FR44.1 IC6.A7(AVDD)

### Layout directives
net class VCC1P8_FX3: VCC1P8_FX3
net class VCC3P3_FX3: VCC3P3_FX3
net class VCC3P3_CFX3: VCC3P3_CFX3
net class VDD_FX3: VDD_FX3

### Notes on the sheet
- Number of NF elements on sheet: 2
- NF elements on sheet: FR40, FR41
- USB3 power block
- (near FR40) NF
- (near FR41) NF
- Project name:
- Title:
- Size:
- Date:
- A4
- Revision:
- Time:
- Sheet
- of
- File:

### Library data of the parts
C143 C150 C158 C161 C163 C164 = Cap_0603: Manufacturer Part Number 1: C1608X5R1A226M080AC; Part Description: 22µF ±20% 10V X5R Ceramic Capacitor -55°C ~ 85°C Surface Mount, MLCC 0603 (1608 Metric) 0.063" L x 0.031" W (1.60mm x 0.80mm); Voltage Rating DC: 10 V; Brand: TDK; Temperature Coefficient / Code: +/- 15 %; Tolerance: 20 %; Type: Multilayer Ceramic Chip Capacitor; Supplier 1: Mouser; Supplier Part Number 1: 810-C1608X5R1A226M; Package / Case: 0603 (1608 metric); Category: Multilayer Ceramic Capacitors MLCC - SMD/SMT; Capacitance: 22 uF; Operating Temperature Range: - 55 C to + 85 C; Case Code - in: 0603; Case Code - mm: 1608; Value: 22uF, 10%
C144 C145 C148 C151 C153 C157 C159 C160 C162 C165-C172 = Cap_0603: as C130 on sheet 11_USB3_0_device; Supplier 1: Mouser; Supplier Part Number 1: 81-GRM155R71C104KA88; Tolerance: 10 %; Case Code - in: 0402; Manufacturer: Murata Electronics; Category: Multilayer Ceramic Capacitors MLCC - SMD/SMT; Value: 100nF, 10%; Manufacturer Part Number: GRM155R71C104KA88D
C146 C147 C149 C152 C154 C156 C173-C180 = Cap_0603: Part Description: 10000pF ±10% 50V X7R Ceramic Capacitor -55°C ~ 125°C Surface Mount, MLCC 0402 (1005 Metric) 0.039" L x 0.020" W (1.00mm x 0.50mm); Manufacturer: Yageo; Capacitance: 10000pF; Voltage - Rated: 50V; Supplier 1: Digi-Key; Supplier Part Number 1: 311-1349-2-ND; Category: Capacitors; Package / Case: 0402 (1005 Metric); Tolerance: ±10%; Value: 10nF, 10%
C155 = Cap_0603: Manufacturer Part Number 1: CC0603MRX5R5BB106; Part Description: 10µF ±20% 6.3V X5R Ceramic Capacitor -55°C ~ 85°C Surface Mount, MLCC 0603 (1608 Metric) 0.063" L x 0.031" W (1.60mm x 0.80mm); Manufacturer: Yageo; Capacitance: 10µF; Tolerance: ±20%; Supplier 1: Digi-Key; Supplier Part Number 1: 311-1448-2-ND; Package / Case: 0603 (1608 Metric); Category: Capacitors; Voltage - Rated: 6.3V; Value: 10uF, 6.3V
FR38-FR46 = Ferrite: Manufacturer Part Number 1: MPZ2012S601A; Manufacturer: TDK; Part Description: FERRITE BEAD 600 OHM 0805 1LN; Impedance Tolerance: ± 25%; Impedance @ 100MHz: 600; Ferrite Mounting: SMD; DC Resistance Max: 0.1; DC Current Rating: 2; Ferrite Case Style: 0805 [2012 Metric]; Supplier 1: Farnell; Supplier Part Number 1: 1669753RL; Supplier: Farnell; Core Material: Ferrite; Value: 600R, 2A
IC6 = CYUSB3014-BZXC: as IC6 on sheet 11_USB3_0_device; DatasheetVersion: Rev. *O; PackageVersion: Rev. *D; PackageReference: BZX121; PackageDescription: 121-Ball FBGA, Body 10 x 10 mm, Pitch 0.8 mm; Supplier 1: Digi-Key; Supplier Part Number 1: 428-3182-ND; Supplier 2: Farnell; Supplier Part Number 2: 2355789; Supplier 3: Newark; Supplier Part Number 3: 54W7901; Supplier 4: Mouser; Supplier Part Number 4: 727-CYUSB3014-BZXC; Max. Operating Temp. (degreesC): 70; Min. Operating Temp. (degreesC): 0; RoHS: Pb-Free; Mounting Technology: Surface Mount; Code_JEDEC: PUB 95; PartNumber: CYUSB3014-BZXC; ComponentLink1Description: Manufacturer URL; ComponentLink1URL: http://www.cypress.com/; ComponentLink2Description: Datasheet; ComponentLink2URL: http://www.cypress.com/?docID=49087; ComponentLink3Description: Package Specification; ComponentLink3URL: http://www.cypress.com/?docID=45795; Part Description: EZ-USB(R) FX3: SuperSpeed USB Controller, 512 KB, 60 I/Os, 0 to 70 degC, 121-Pin FBGA (BZX121)